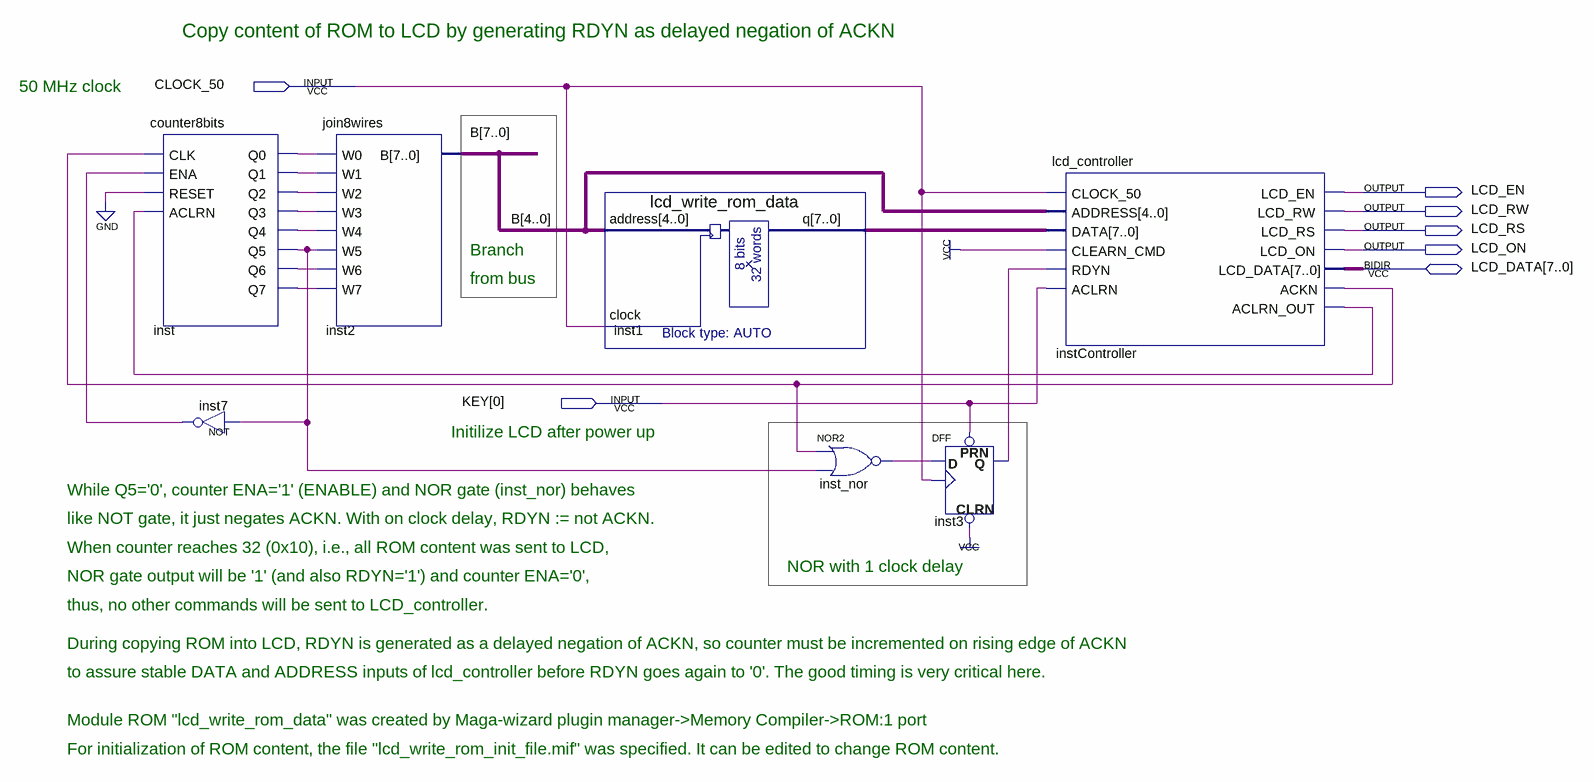
[diagram p0: schematic sheet]
// Quartus schematic lcd_demo_rom_schema.bdf as structural Verilog: 7 symbols, 7 pins
module lcd_demo_rom_schema (
  input  CLOCK_50,
  input  [0:0] KEY,
  inout  [7:0] LCD_DATA,
  output LCD_EN,
  output LCD_RW,
  output LCD_RS,
  output LCD_ON
);

  wire inst3_q, inst7_out, inst_nor_out, inst_q0, inst_q1, inst_q2, inst_q3, inst_q4, inst_q5, inst_q6,
       inst_q7, instController_ackn, instController_aclrn_out;
  wire [7:0] B, inst1_q;

  counter8bits inst (
    .CLK(instController_ackn), .ENA(inst7_out), .RESET(1'b0), .ACLRN(instController_aclrn_out), .Q0(inst_q0),
    .Q1(inst_q1), .Q2(inst_q2), .Q3(inst_q3), .Q4(inst_q4), .Q5(inst_q5), .Q6(inst_q6), .Q7(inst_q7));
  not inst7 (inst7_out, inst_q5);
  join8wires inst2 (
    .W0(inst_q0), .W1(inst_q1), .W2(inst_q2), .W3(inst_q3), .W4(inst_q4), .W5(inst_q5), .W6(inst_q6),
    .W7(inst_q7), .B(B));
  lcd_write_rom_data inst1 (.address(B[4:0]), .clock(CLOCK_50), .q(inst1_q));
  nor inst_nor (inst_nor_out, instController_ackn, inst_q5);
  DFF inst3 (.CLRN(1'b1), .CLK(CLOCK_50), .D(inst_nor_out), .PRN(KEY[0]), .Q(inst3_q));
  lcd_controller instController (
    .CLOCK_50(CLOCK_50), .ADDRESS(B[4:0]), .DATA(inst1_q), .CLEARN_CMD(1'b1), .RDYN(inst3_q), .ACLRN(KEY[0]),
    .LCD_EN(LCD_EN), .LCD_RW(LCD_RW), .LCD_RS(LCD_RS), .LCD_ON(LCD_ON), .ACKN(instController_ackn),
    .ACLRN_OUT(instController_aclrn_out), .LCD_DATA(LCD_DATA));

  // Notes on the sheet:
  //   Copy content of ROM to LCD by generating RDYN as delayed negation of ACKN
  //   50 MHz clock
  //   Branch
  //   from bus
  //   Initilize LCD after power up
  //   While Q5='0', counter ENA='1' (ENABLE) and NOR gate (inst_nor) behaves
  //   like NOT gate, it just negates ACKN. With on clock delay, RDYN := not ACKN.
  //   When counter reaches 32 (0x10), i.e., all ROM content was sent to LCD,
  //   NOR with 1 clock delay
  //   NOR gate output will be '1' (and also RDYN='1') and counter ENA='0',
  //   thus, no other commands will be sent to LCD_controller.
  //   During copying ROM into LCD, RDYN is generated as a delayed negation of ACKN, so counter must be incremented on rising edge of ACKN
  //   to assure stable DATA and ADDRESS inputs of lcd_controller before RDYN goes again to '0'. The good timing is very critical here.
  //   Module ROM "lcd_write_rom_data" was created by Maga-wizard plugin manager->Memory Compiler->ROM:1 port
  //   For initialization of ROM content, the file "lcd_write_rom_init_file.mif" was specified. It can be edited to change ROM content.
endmodule
